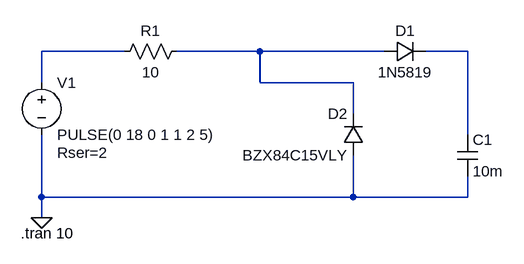
[diagram p0: schematic solar-charge-protection-module-v1.asc]
solar-charge-protection-module-v1.asc, the LTspice schematic file:
Version 4.1
SHEET 1 1060 680
WIRE -16 0 -144 0
WIRE 192 0 64 0
WIRE 384 0 192 0
WIRE 512 0 448 0
WIRE -144 48 -144 0
WIRE 192 48 192 0
WIRE 336 48 192 48
WIRE 336 96 336 48
WIRE 512 128 512 0
WIRE -144 224 -144 128
WIRE 336 224 336 160
WIRE 336 224 -144 224
WIRE 512 224 512 192
WIRE 512 224 336 224
WIRE -144 256 -144 224
FLAG -144 256 0
SYMBOL voltage -144 32 R0
WINDOW 123 0 0 Left 0
WINDOW 39 24 124 Left 2
SYMATTR SpiceLine Rser=2
SYMATTR InstName V1
SYMATTR Value PULSE(0 18 0 1 1 2 5)
SYMBOL diode 384 16 R270
WINDOW 0 32 32 VTop 2
WINDOW 3 0 32 VBottom 2
SYMATTR InstName D1
SYMATTR Value 1N5819
SYMBOL diode 352 160 R180
WINDOW 0 24 64 Left 2
WINDOW 3 24 0 Left 2
SYMATTR InstName D2
SYMATTR Value BZX84C15VLY
SYMBOL cap 496 128 R0
SYMATTR InstName C1
SYMATTR Value 10m
SYMATTR SpiceLine V=10
SYMBOL res -32 16 R270
WINDOW 0 32 56 VTop 2
WINDOW 3 0 56 VBottom 2
SYMATTR InstName R1
SYMATTR Value 10
TEXT -176 280 Left 2 !.tran 10

The netlist it stands for:
* solar-charge-protection-module-v1.asc
V1 N001 0 PULSE(0 18 0 1 1 2 5) Rser=2
D1 N002 N003 1N5819
D2 0 N002 BZX84C15VLY
C1 N003 0 10m V=10
R1 N001 N002 10
.model D D
.lib standard.dio
.tran 10
.backanno
.end